# EAGLE schematic PCB (EAGLE 7.6.0)
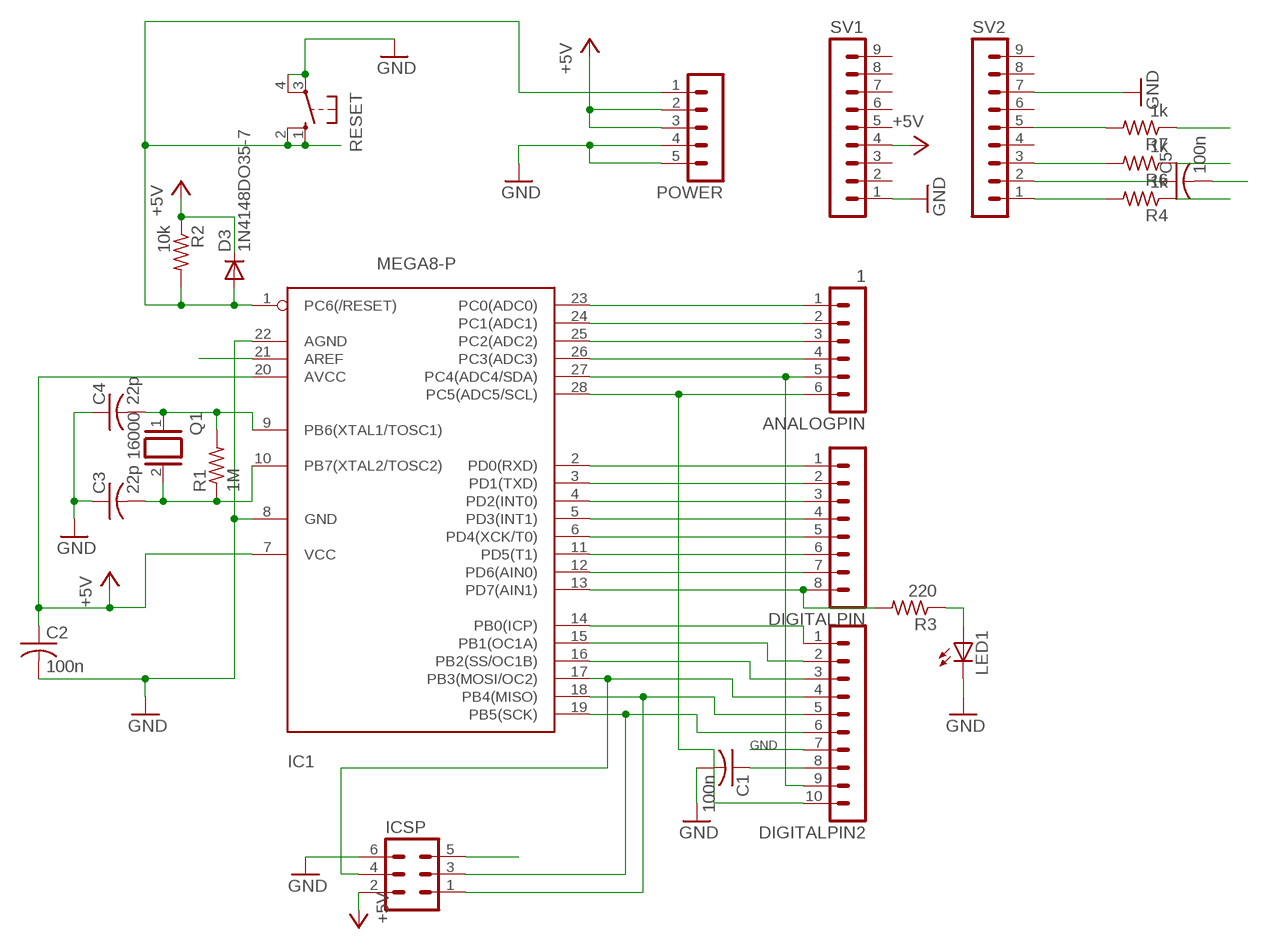
[diagram p0: schematic, sheet 1]

## Parts
ANALOGPIN  1  MA06-1  [MA06-1]
C1  100n  C-US025-024X044  [C025-024X044]
C2  100n  C-US025-024X044  [C025-024X044]
C3  22p  C-US025-024X044  [C025-024X044]
C4  22p  C-US025-024X044  [C025-024X044]
C5  100n  C-US025-024X044  [C025-024X044]
D3  1N4148DO35-7  [DO35-7]
DIGITALPIN  MA08-1  [MA08-1]
DIGITALPIN2  MA10-1  [MA10-1]
IC1  MEGA8-P  [DIL28-3]
ICSP  MA03-2  [MA03-2]
LED1  LED3MM  [LED3MM]
POWER  MA05-1  [MA05-1]
Q1  16000  XTAL/S  [QS]
R1  1M  R-US_0204/7  [0204/7]
R2  10k  R-US_0204/7  [0204/7]
R3  220  R-US_0204/7  [0204/7]
R4  1k  R-US_0204/7  [0204/7]
R6  1k  R-US_0204/7  [0204/7]
R7  1k  R-US_0204/7  [0204/7]
RESET  10-XX  [B3F-10XX]
SV1  MA09-1  [MA09-1]
SV2  MA09-1  [MA09-1]

## Nets
+5V: C2.1 D3.C IC1.7(VCC) IC1.20(AVCC) ICSP.2 POWER.2 POWER.3 R2.1 SV1.4
AREF: C1.1 DIGITALPIN2.8 IC1.21(AREF)
GND: C1.2 C2.2 C3.1 C4.1 DIGITALPIN2.7 IC1.8(GND) IC1.22(AGND) ICSP.6 LED1.K(C) POWER.4 POWER.5 RESET.3(P) RESET.4(P1) SV1.1 SV2.7
N$1: C4.2 IC1.9(PB6(XTAL1/TOSC1)) Q1.1 R1.2
N$2: C3.2 IC1.10(PB7(XTAL2/TOSC2)) Q1.2 R1.1
N$3: LED1.A R3.1
N$4: C5.1 SV2.2
N$5: R7.2 SV2.5
N$6: DIGITALPIN.3 IC1.4(PD2(INT0))
N$7: DIGITALPIN.4 IC1.5(PD3(INT1))
N$8: DIGITALPIN.5 IC1.6(PD4(XCK/T0))
N$9: DIGITALPIN.6 IC1.11(PD5(T1))
N$10: DIGITALPIN.7 IC1.12(PD6(AIN0))
N$11: DIGITALPIN.8 IC1.13(PD7(AIN1)) R3.2
N$12: ANALOGPIN.1 IC1.23(PC0(ADC0))
N$13: ANALOGPIN.2 IC1.24(PC1(ADC1))
N$14: ANALOGPIN.3 IC1.25(PC2(ADC2))
N$15: ANALOGPIN.4 IC1.26(PC3(ADC3))
N$16: ANALOGPIN.5 DIGITALPIN2.9 IC1.27(PC4(ADC4/SDA))
N$17: R4.2 SV2.1
N$18: DIGITALPIN2.1 IC1.14(PB0(ICP))
N$19: DIGITALPIN2.2 IC1.15(PB1(OC1A))
N$20: DIGITALPIN2.3 IC1.16(PB2(SS/OC1B))
N$22: DIGITALPIN2.5 IC1.18(PB4(MISO)) ICSP.1
N$23: DIGITALPIN2.6 IC1.19(PB5(SCK)) ICSP.3
N$24: R6.2 SV2.3
N$25: DIGITALPIN2.4 IC1.17(PB3(MOSI/OC2)) ICSP.4
N$27: ANALOGPIN.6 DIGITALPIN2.10 IC1.28(PC5(ADC5/SCL))
RES1: C5.2 D3.A IC1.1(PC6(/RESET)) ICSP.5 POWER.1 R2.2 R6.1 RESET.1(S) RESET.2(S1)
RXD: DIGITALPIN.1 IC1.2(PD0(RXD)) R4.1
TXD: DIGITALPIN.2 IC1.3(PD1(TXD)) R7.1
Unconnected: SV1.2 SV1.3 SV1.5 SV1.6 SV1.7 SV1.8 SV1.9 SV2.4 SV2.6 SV2.8 SV2.9

## Library data of the parts
ANALOGPIN = con-lstb:MA06-1: PIN HEADER
C1-C5 = rcl:C-US: CAPACITOR, American symbol
D3 = diode:1N4148: DIODE high speed (Philips)
DIGITALPIN = con-lstb:MA08-1: PIN HEADER
DIGITALPIN2 = con-lstb:MA10-1: PIN HEADER
IC1 = atmel:MEGA8-P: MICROCONTROLLER 8 Kbytes FLASH, 1 kbytes SRAM, 512 bytes EEPROM, USART, 4-channel 10 bit ADC, 2-channel 8 bit ADC Pin compatible with Atmega48, ATMega88, ATMega168 Source: avr.lbr
ICSP = con-lstb:MA03-2: PIN HEADER
LED1 = led:LED: LED OSRAM: - CHIPLED LG R971, LG N971, LY N971, LG Q971, LY Q971, LO R971, LY R971 LH N974, LH R974 LS Q976, LO Q976, LY Q976 LO Q996 - Hyper CHIPLED LW Q18S LB Q993, LB Q99A, LB R99A - SideLED LS A670, LO A670, LY A670, LG A670, LP A670 LB A673, LV A673, LT A673, LW A673 LH A674 LY A675 LS A676, LA A676, LO A676, LY A676, LW A676 LS A679, LY A679, LG A679 - Hyper Micro SIDELED® LS Y876, LA Y876, LO Y876, LY Y876 LT Y87S - SmartLED LW L88C, LW L88S LB L89C, LB L89S, LG L890 LS L89K, LO L89K, LY L89K LS L896, LA L896, LO L896, LY L896 - TOPLED LS T670, LO T670, LY T670, LG T670, LP T670 LSG T670, LSP T670, LSY T670, LOP T670, LYG T670 LG T671, LOG T671, LSG T671 LB T673, LV T673, LT T673, LW T673 LH T674 LS T676, LA T676, LO T676, LY T676, LB T676, LH T676, LSB T676, LW T676 LB T67C, LV T67C, LT T67C, LS T67K, LO T67K, LY T67K, LW E67C LS E67B, LA E67B, LO E67B, LY E67B, LB E67C, LV E67C, LT E67C LW T67C LS T679, LY T679, LG T679 LS T770, LO T770, LY T770, LG T770, LP T770 LB T773, LV T773, LT T773, LW T773 LH T774 LS E675, LA E675, LY E675, LS T675 LS T776, LA T776, LO T776, LY T776, LB T776 LHGB T686 LT T68C, LB T68C - Hyper Mini TOPLED® LB M676 - Mini TOPLED Santana® LG M470 LS M47K, LO M47K, LY M47K Source: http://www.osram.convergy.de LUXEON: - LUMILED® LXK2-PW12-R00, LXK2-PW12-S00, LXK2-PW14-U00, LXK2-PW14-V00 LXK2-PM12-R00, LXK2-PM12-S00, LXK2-PM14-U00 LXK2-PE12-Q00, LXK2-PE12-R00, LXK2-PE12-S00, LXK2-PE14-T00, LXK2-PE14-U00 LXK2-PB12-K00, LXK2-PB12-L00, LXK2-PB12-M00, LXK2-PB14-N00, LXK2-PB14-P00, LXK2-PB14-Q00 LXK2-PR12-L00, LXK2-PR12-M00, LXK2-PR14-Q00, LXK2-PR14-R00 LXK2-PD12-Q00, LXK2-PD12-R00, LXK2-PD12-S00 LXK2-PH12-R00, LXK2-PH12-S00 LXK2-PL12-P00, LXK2-PL12-Q00, LXK2-PL12-R00 Source: www.luxeon.com KINGBRIGHT: KA-3528ASYC Source: www.kingbright.com
POWER = con-lstb:MA05-1: PIN HEADER
Q1 = special:XTAL/S: CRYSTAL
R1-R4 R6 R7 = rcl:R-US_: RESISTOR, American symbol
RESET = switch-omron:10-XX: OMRON SWITCH
SV1 SV2 = con-lstb:MA09-1: PIN HEADER